# Altium schematic sheet LEDs.SchDoc
size A4; SheetNumber: 12; SheetTotal: 12
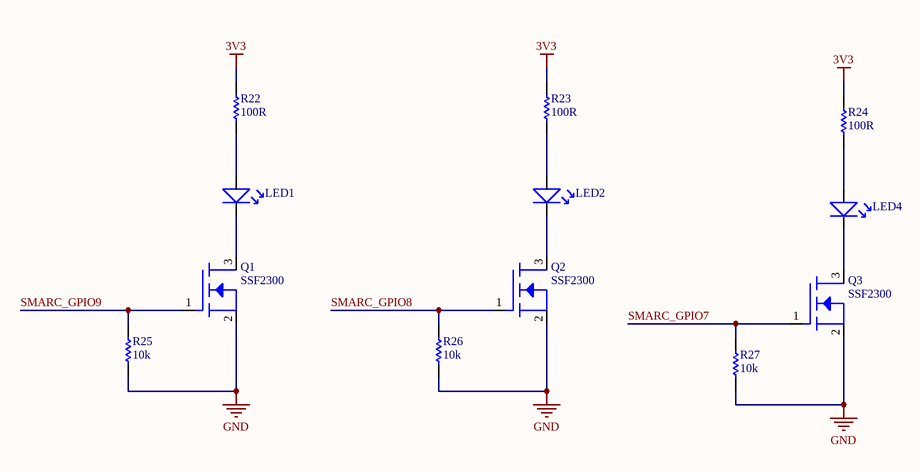
[diagram p0: LEDs.SchDoc]

## Parts
LED1  0603 LED  [0603 LED]  (value not drawn)
LED2  0603 LED  [0603 LED]  (value not drawn)
LED4  0603 LED  [0603 LED]  (value not drawn)
Q1  SSF2300  [SSF2300]
Q2  SSF2300  [SSF2300]
Q3  SSF2300  [SSF2300]
R22  100R  [RES-0603]
R23  100R  [RES-0603]
R24  100R  [RES-0603]
R25  10k  [RES-0603]
R26  10k  [RES-0603]
R27  10k  [RES-0603]

## Nets
3V3: R22.2 R23.2 R24.2
GND: Q1.2 Q2.2 Q3.2 R25.1 R26.1 R27.1
SMARC_GPIO7: Q3.1 R27.2
SMARC_GPIO8: Q2.1 R26.2
SMARC_GPIO9: Q1.1 R25.2
NetLED1_1: LED1.1 R22.1
NetLED1_2: LED1.2 Q1.3
NetLED2_1: LED2.1 R23.1
NetLED2_2: LED2.2 Q2.3
NetLED4_1: LED4.1 R24.1
NetLED4_2: LED4.2 Q3.3

## Library data of the parts
Q1-Q3 = SSF2300: NMOS 20V 4.5A SOT23
R22-R27 = RES-0603: Resistor chip. 0603